# EasyEDA Pro project stm32手表_2024-06-10.epro, board PCB1
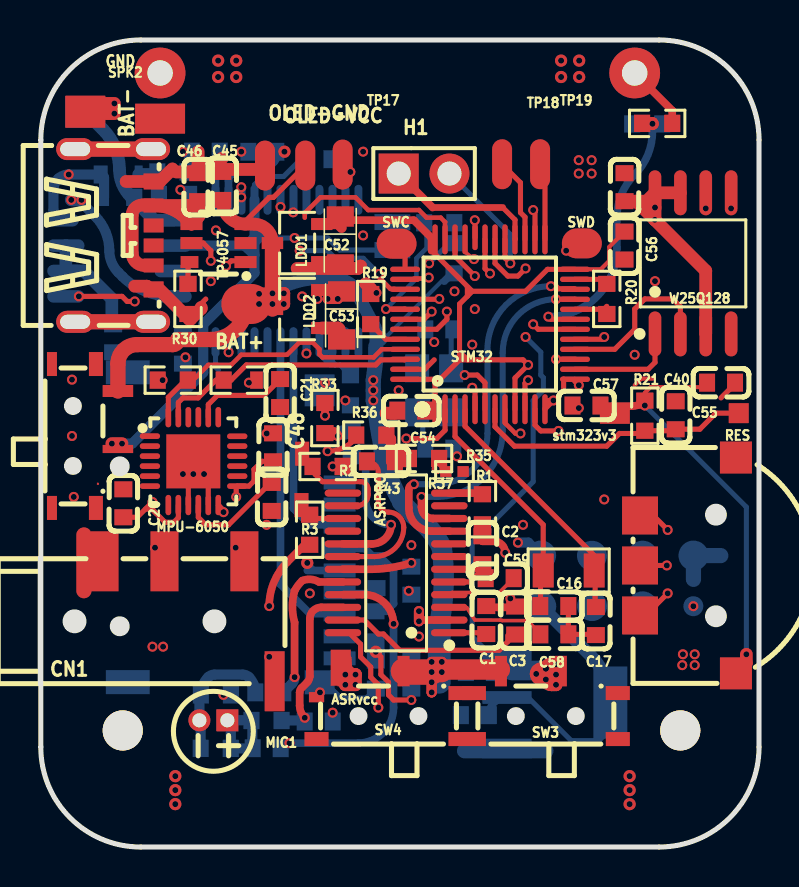
[diagram p1: board, top side]
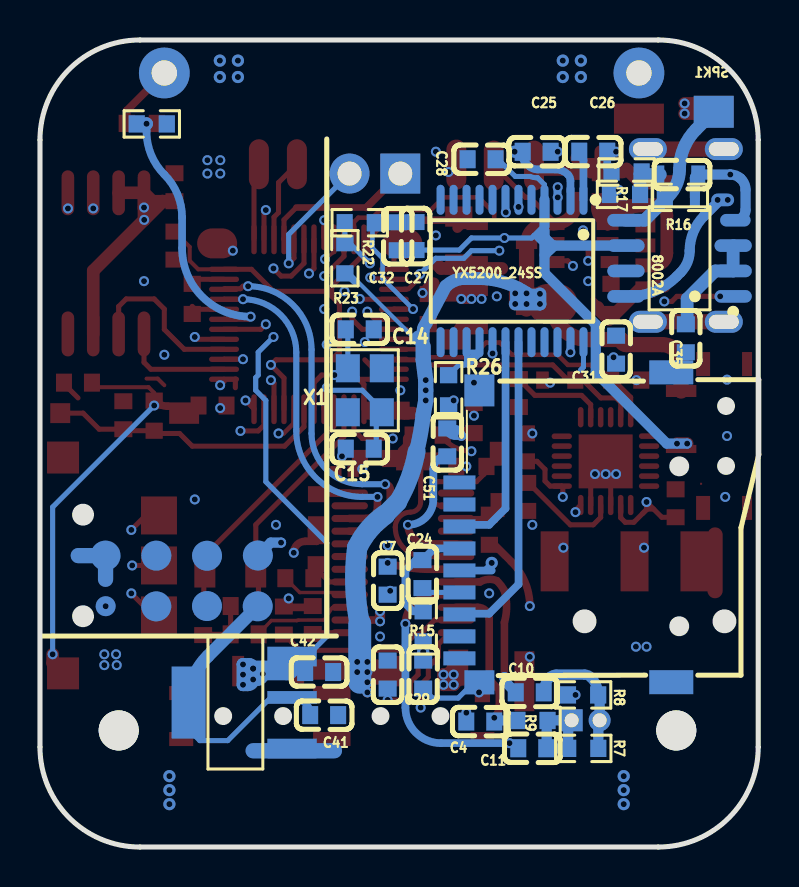
[diagram p2: board, bottom side, seen from below]

Outline 35.94 x 40.38 mm; copper layers: Top Layer, Inner1, Inner2, Bottom Layer. Coordinates in mm from the lower left corner of the outline.
Outline path: 0,35.38 0,5 arc(1.46,1.46) 5,0 30.94,0 arc(34.48,1.46) 35.94,5 35.94,35.38 arc(34.48,38.91) 30.94,40.38 5,40.38 arc(1.46,38.91) 0,35.38
Stack: Top Layer 0.035mm 外层铜厚1oz / Dielectric1 0.2104mm 7628 RC49% 8.6mil / Inner1 0.0152mm 内层铜厚 / Dielectric2 1.065mm 1.1mm H/HOZ 含铜 / Inner2 0.0152mm 内层铜厚 / Dielectric3 0.2104mm 7628 RC49% 8.6mil / Bottom Layer 0.035mm 外层铜厚1oz

## Design rules (mm)
template: JLCPCB Capability(Two Layers Board)
spacing copperThickness1oz (default): track to track 0.102, other pairs 0.152 to 0.3
spacing copperThickness2oz: track to track 0.203, other pairs 0.152 to 0.3
track width copperThickness1oz (default): min 0.127, default 0.254, max 2.54
track width copperThickness2oz: min 0.203, default 0.254, max 2.54
differential pair differentialPair (default): width min 0.127, default 0.254, max 2.54; gap min 0.152, default 0.152
via viaSize (default): diameter min 0.5, default 0.61, max 10; hole min 0.3, default 0.305, max 6.3

## Placement (name value [footprint] x y rotation side)
8002A  AiP8002SA.TR  [sop-8_l4.9-w3.9-p1.27-ls6.0-bl]  3.94 29.45 90 bottom
ASR_DL_RX  -  [test-point-0.5mm#2]  13.04 17.11 0 top
ASR_DL_TX  -  [test-point-0.5mm#2]  13.08 19.67 0 top
ASRPRO  ASRPRO-2M  [SSOP-24_L8.7-W3.9-P0.64-LS6.0-BL-1]  17.78 14.21 90 top
ASRvcc  -  [test-point-0.5mm#3]  15.01 8.97 0 top
BAT+  -  [test-point-0.5mm#4]  10.29 27.17 270 top
BAT-  -  [test-point-0.5mm#5]  5.97 36.44 270 top
C1  4.7uF  [C0603]  22.29 11.36 90 top
C2  4.7uF  [C0603]  22.1 14.85 270 top
C3  4.7uF  [C0603]  23.74 11.33 90 top
C4  4.7uF  [C0603]  13.91 6.28 0 bottom
C7  100nF  [C0603]  18.54 13.33 270 bottom
C10  100nF  [C0603]  11.43 7.74 0 bottom
C11  100nF  [C0603]  11.31 4.94 0 bottom
C14  18pF  [C0603]  19.94 25.9 180 bottom
C15  18pF  [C0603]  19.94 19.93 0 bottom
C16  10pF  [C0603]  25.7 12.06 0 top
C17  10pF  [C0603]  27.77 11.3 270 top
C20  10nF  [C0603]  4.13 17.2 90 top
C21  2.2nF  [C0603]  11.98 22.71 270 top
C24  10uF  [C0603]  16.8 13.65 90 bottom
C25  10uF  [C0603]  11.09 34.78 180 bottom
C26  10uF  [C0603]  8.25 34.79 180 bottom
C27  100nF  [C0603]  17.15 30.57 270 bottom
C28  10uF  [C0603]  13.84 34.41 0 bottom
C29  10uF  [C0603]  18.54 8.63 90 bottom
C30  100nF  [C0603]  16.76 8.63 90 bottom
C31  10uF  [C0603]  7.11 24.88 270 bottom
C32  10uF  [C0603]  18.04 30.55 270 bottom
C34  100nF  [c0603]  3.81 33.64 0 bottom
C35  1uF  [C0603]  3.62 25.45 90 bottom
C40  1uF  [C0603]  31.77 21.6 270 top
C41  10uF  [C0603]  21.72 6.6 0 bottom
C42  10uF  [C0603]  21.97 8.75 180 bottom
C43  100nF  [C0603]  17.02 19.29 180 top
C45  10uF  [C0603]  9.08 33.08 90 top
C46  10uF  [C0603]  7.88 33.01 90 top
C48  100nF  [C0603]  11.62 20 90 top
C49  100nF  [C0603]  11.56 17.52 90 top
C50  100nF  [C0603]  29.21 33.01 270 top
C51  100nF  [C0603]  15.56 20.25 270 bottom
C52  10uF  [case-a_3216]  14.99 30.34 270 top
C53  10uF  [case-a_3216]  15.05 26.59 270 top
C54  100nF  [C0603]  18.54 21.83 0 top
C55  100nF  [C0603]  34.04 23.23 180 top
C56  10uF  [C0603]  29.21 30.09 90 top
C57  100nF  [C0603]  27.31 22.09 0 top
C58  4.7uF  [C0603]  25.7 10.64 180 top
C59  4.7uF  [C0603]  22.96 13.45 0 top
CARD1  TF-01A  [TF-SMD_TF-02]  9.65 15.99 90 bottom
CN1  PJ-320D  [audio-smd_pj-320d]  7.24 11.29 90 top
H1  PZ254V-11-02P  [HDR-TH_2P-P2.54-V-M]  19.18 33.69 0 top
LDO1  ME6209A33M3G  [SOT-23-3_L2.9-W1.6-P1.90-LS2.8-BR]  12.83 30.22 0 top
LDO2  ME6209A33M3G  [SOT-23-3_L2.9-W1.6-P1.90-LS2.8-BR]  12.83 26.91 0 top
MIC1  4015P  [MIC-TH_BD4.0-P1.40-D0.4-L-FD]  8.64 6.34 180 top
MPU-6050  MPU-6050  [qfn-24_l4.0-w4.0-p0.50-bl-ep2.7]  7.63 19.31 270 top
NOREF  -  [Pad_e32]  32 5.83 0 top
NOREF#2  -  [Pad_e629]  5.97 38.73 315 top
NOREF#3  -  [Pad_e594]  29.72 38.73 315 top
NOREF#4  -  [Pad_e10]  4.1 5.83 0 top
OLED-GND  -  [test-point-0.5mm#6]  11.22 34.09 0 top
OLED-VCC  -  [test-point-0.5mm#6]  13.23 34.09 0 top
R1  10K  [R0603]  22.1 16.9 90 top
R2  10K  [R0603]  14.35 19.04 180 top
R3  10K  [R0603]  13.45 15.87 90 top
R7  10kΩ  [R0603]  8.75 4.93 0 bottom
R8  2.2kΩ  [R0603]  8.76 7.61 0 bottom
R9  2.2kΩ  [R0603]  11.29 6.33 0 bottom
R15  3.3Ω  [R0603]  16.76 11.04 270 bottom
R16  24kΩ  [r0603#2]  3.92 32.5 0 bottom
R17  22kΩ  [R0603]  6.67 32.65 180 bottom
R18  22kΩ  [R0603]  6.59 33.77 180 bottom
R19  10kΩ  [R0603]  16.51 26.91 270 top
R20  10kΩ  [R0603]  28.32 27.42 90 top
R21  10kΩ  [R0603]  30.23 21.58 270 top
R22  33kΩ  [R0603]  19.94 31.23 180 bottom
R23  33kΩ  [R0603]  20.68 29.45 90 bottom
R24  43kΩ  [R0603]  30.84 36.2 0 top
R25  5.1kΩ  [R0603]  30.34 36.18 180 bottom
R26  33K  [R0603]  15.49 22.85 270 bottom
R30  3K  [R0603]  7.37 27.42 270 top
R31  4.7K  [R0603]  6.6 23.36 180 top
R32  4.7K  [r0603]  9.91 23.36 0 top
R33  4.7K  [R0603]  14.22 21.46 270 top
R35  0Ω  [R0402]  20.7 18.79 180 top
R36  22kΩ  [R0603]  16.54 20.61 180 top
R37  4.7kΩ  [R0603]  19.18 19.44 0 top
RES  -  [test-point-0.5mm#7]  34.93 21.71 0 top
SPK1  -  [test-point-0.5mm#8]  2.23 36.78 180 top
SPK2  -  [test-point-0.5mm#9]  2.23 36.79 180 top
STM32  STM32F103C8T6  [lqfp-48_l7.0-w7.0-p0.50-ls9.0-bl]  22.48 26.15 0 top
stm323v3  -  [test-point-0.5mm]  28.73 21.67 0 top
SW1  K1-1502SA-02  [KEY-SMD_K1-1502SA-02]  32.38 14.09 270 top
SW2  MSK12C02  [sw-th_msk12c02]  2.16 20.56 270 top
SW3  MSK12C02  [sw-th_msk12c02#3]  25.27 7.1 0 top
SW4  MSK12C02  [sw-th_msk12c02#2]  17.4 7.1 0 top
SWC  -  [test-point-0.5mm#10]  17.8 30.18 0 top
SWD  -  [test-point-0.5mm#10]  27.07 30.2 0 top
TP1  -  [test-point-0.5mm#11]  25.04 12.04 180 bottom
TP2  -  [test-point-0.5mm#11]  27.58 12.06 180 bottom
TP3  -  [test-point-0.5mm#11]  30.12 12.04 180 bottom
TP4  -  [test-point-0.5mm#12]  32.65 12.05 180 bottom
TP11  -  [test-point-0.5mm#11]  25.04 14.59 180 bottom
TP12  -  [test-point-0.5mm#11]  27.58 14.57 180 bottom
TP13  -  [test-point-0.5mm#11]  30.12 14.58 180 bottom
TP14  -  [test-point-0.5mm#11]  32.66 14.58 180 bottom
TP17  -  [test-point-0.5mm#6]  15.1 34.14 0 top
TP18  -  [test-point-0.5mm#6]  23.08 34.16 0 top
TP19  -  [test-point-0.5mm#6]  24.99 34.16 180 top
TP4057  TP4057  [sot-23-6_l2.9-w1.6-p0.95-ls2.8-br]  8.89 30.22 0 top
TYPE-C  TYPE-C 6P(073)  [TYPE-C-SMD_TYPE-C-6P]  3.68 30.6 270 top
U9  AMS1117-3.3  [sot-223-4_l6.5-w3.5-p2.30-ls7.0-br]  26.16 7.23 180 bottom
W25Q128  W25Q128JVSIQ  [SOIC-8_L5.3-W5.3-P1.27-LS8.0-BL]  32.64 29.2 0 top
X1  8MHz  [CRYSTAL-SMD_4P-L3.2-W2.5-BL]  19.69 22.85 270 bottom
X2  32.768kHz  [OSC-SMD_L3.2-W1.5]  26.42 13.83 180 top
YX5200_24SS  YX5200-24SS  [SSOP-24_L8.2-W5.3-P0.65-LS7.8-BL]  12.32 28.82 0 bottom

## Footprints (pads in the part's own frame, mm; a bottom-side part is the same pattern mirrored in y, then rotated)
audio-smd_pj-320d
  rect 3x1 smd: 1(-3,-4.461)
  rect 3x1.4 smd: 2(3,4.05) 3(3,1.05) 4(3,-2.95)
C0603
  rect 0.8x0.9 smd: 1(-0.7,0) 2(0.7,0)
c0603
  rect 0.7x0.9 smd: 1(-0.813,0)
  rect 0.4x0.9 smd: 2(1.087,0)
case-a_3216
  rect 1.016x1.359 smd: 1(-1.2,0) 2(1.2,0)
CRYSTAL-SMD_4P-L3.2-W2.5-BL
  rect 1.4x1.2 smd: 1(-1.1,-0.85) 2(1.1,-0.85) 3(1.1,0.85) 4(-1.1,0.85)
HDR-TH_2P-P2.54-V-M
  rect 2x2 hole 1.2: 1(-1.27,0)
  round 2 hole 1.2: 2(1.27,0)
KEY-SMD_K1-1502SA-02
  rect 1.9x1.8 smd: 1(-2.5,-2.4) 2(2.5,-2.4) T(0,-2.4)
  rect 1.6x1.6 smd: 3(-5.4,2.4) C(5.4,2.4)
lqfp-48_l7.0-w7.0-p0.50-ls9.0-bl
  oval 0.27x1.5 smd: 1(-2.75,-4.25) 2(-2.25,-4.25) 3(-1.75,-4.25) 4(-1.25,-4.25) 5(-0.75,-4.25) 6(-0.25,-4.25) 7(0.25,-4.25) 8(0.75,-4.25) 9(1.25,-4.25) 10(1.75,-4.25) 11(2.25,-4.25) 12(2.75,-4.25) 25(2.75,4.25) 26(2.25,4.25) 27(1.75,4.25) 28(1.25,4.25) 29(0.75,4.25) 30(0.25,4.25) 31(-0.25,4.25) 33(-1.25,4.25) 34(-1.75,4.25) 35(-2.25,4.25) 36(-2.75,4.25)
  oval 1.5x0.27 smd: 13(4.25,-2.75) 14(4.25,-2.25) 15(4.25,-1.75) 16(4.25,-1.25) 17(4.25,-0.75) 18(4.25,-0.25) 19(4.25,0.25) 20(4.25,0.75) 21(4.25,1.25) 22(4.25,1.75) 23(4.25,2.25) 24(4.25,2.75) 37(-4.25,2.75) 38(-4.25,2.25) 39(-4.25,1.75) 40(-4.25,1.25) 41(-4.25,0.75) 42(-4.25,0.25) 43(-4.25,-0.25) 44(-4.25,-0.75) 45(-4.25,-1.25) 46(-4.25,-1.75) 47(-4.25,-2.25) 48(-4.25,-2.75)
  oval 0.27x1.27 smd: 32(-0.75,4.343)
MIC-TH_BD4.0-P1.40-D0.4-L-FD
  rect 1.1x1.1 hole 0.7: 1(-0.7,0)
  round 1.1 hole 0.7: 2(0.7,0)
OSC-SMD_L3.2-W1.5
  rect 1.05x1.7 smd: 1(-1.275,0) 2(1.275,0)
Pad_e10
  round 2 hole 2: 51(0,0)
Pad_e32
  round 2 hole 2: 53(0,0)
Pad_e594
  round 2.54 hole 1.27: 49(0,0)
Pad_e629
  round 2.54 hole 1.27: 50(0,0)
qfn-24_l4.0-w4.0-p0.50-bl-ep2.7
  oval 0.28x1.016 smd: 1(-1.25,-2.171) 2(-0.75,-2.171) 3(-0.25,-2.171) 4(0.25,-2.171) 5(0.75,-2.171) 6(1.25,-2.171) 13(1.25,2.197) 14(0.75,2.197) 15(0.25,2.197) 16(-0.25,2.197) 17(-0.75,2.197) 18(-1.242,2.197)
  oval 1.016x0.28 smd: 7(2.197,-1.25) 8(2.197,-0.75) 9(2.197,-0.25) 10(2.197,0.25) 11(2.197,0.75) 12(2.197,1.25) 19(-2.197,1.25) 20(-2.197,0.75) 21(-2.197,0.25) 22(-2.197,-0.25) 23(-2.197,-0.75) 24(-2.197,-1.25)
  rect 2.7x2.7 smd: 25(0.013,0)
R0402
  rect 0.566x0.54 smd: 1(-0.433,0) 2(0.433,0)
r0603
  rect 0.806x0.864 smd: 1(-0.753,0)
  rect 0.635x0.864 smd: 2(0.889,0)
R0603
  rect 0.806x0.864 smd: 1(-0.753,0) 2(0.753,0)
r0603#2
  rect 0.5x0.864 smd: 1(-0.753,0)
  rect 0.806x0.864 smd: 2(0.753,0)
SOIC-8_L5.3-W5.3-P1.27-LS8.0-BL
  oval 0.63x2.25 smd: 1(-1.905,-3.53) 2(-0.635,-3.53) 3(0.635,-3.53) 4(1.905,-3.53) 5(1.905,3.53) 6(0.635,3.53) 7(-0.635,3.53) 8(-1.905,3.53)
sop-8_l4.9-w3.9-p1.27-ls6.0-bl
  oval 0.63x1.865 smd: 1(-1.905,-2.683) 2(-0.635,-2.683) 3(0.635,-2.683) 5(1.905,2.683) 6(0.635,2.683) 7(-0.635,2.683) 8(-1.905,2.683)
  oval 0.63x1.524 smd: 4(1.905,-2.794)
SOT-23-3_L2.9-W1.6-P1.90-LS2.8-BR
  rect 1.07x0.6 smd: 1(1.235,-0.95) 2(1.235,0.95) 3(-1.235,0)
sot-23-6_l2.9-w1.6-p0.95-ls2.8-br
  rect 1.1x0.6 smd: 1(1.35,-0.95) 2(1.35,0) 3(1.35,0.95) 4(-1.35,0.95) 5(-1.35,0)
  rect 0.889x0.6 smd: 6(-1.448,-0.95)
sot-223-4_l6.5-w3.5-p2.30-ls7.0-br
  rect 2.47x0.98 smd: 1(2.835,-2.3) 3(2.835,2.3)
  rect 2.47x0.635 smd: 2(2.835,0.254)
  rect 1.7x3.6 smd: 4(-2.338,0)
SSOP-24_L8.2-W5.3-P0.65-LS7.8-BL
  oval 0.4x1.5 smd: 1(-3.575,-3.562) 2(-2.925,-3.562) 3(-2.275,-3.562) 4(-1.625,-3.562) 5(-0.975,-3.562) 6(-0.325,-3.562) 7(0.325,-3.562) 8(0.975,-3.562) 9(1.625,-3.562) 10(2.275,-3.562) 11(2.925,-3.562) 12(3.575,-3.562) 13(3.575,3.562) 14(2.925,3.562) 15(2.275,3.562) 16(1.625,3.562) 17(0.975,3.562) 18(0.325,3.562) 19(-0.325,3.562) 20(-0.975,3.562) 21(-1.625,3.562) 22(-2.275,3.562) 23(-2.925,3.562) 24(-3.575,3.562)
SSOP-24_L8.7-W3.9-P0.64-LS6.0-BL-1
  oval 0.355x1.824 smd: 1(-3.493,-2.662) 2(-2.857,-2.662) 3(-2.223,-2.662) 4(-1.587,-2.662) 5(-0.953,-2.662) 6(-0.318,-2.662) 7(0.318,-2.662) 8(0.953,-2.662) 9(1.587,-2.662) 10(2.223,-2.662) 11(2.857,-2.662) 12(3.493,-2.662) 13(3.493,2.662) 14(2.857,2.662) 15(2.223,2.662) 16(1.587,2.662) 17(0.953,2.662) 18(0.318,2.662) 19(-0.318,2.662) 20(-0.953,2.662) 21(-1.587,2.662) 22(-2.223,2.662) 23(-2.857,2.662) 24(-3.493,2.662)
sw-th_msk12c02
  rect 0.6x1.524 smd: 1(-2.25,1.7)
  rect 0.406x1.524 smd: 2(0.65,1.7)
  rect 0.1x0.1 smd: 3(2.391,0.7)
  rect 1.2x0.7 smd: 4(-3.6,0.6) 4(3.6,0.6)
  rect 1.2x0.5 smd: 4(-3.6,-1.6) 4(3.6,-1.6)
sw-th_msk12c02#2
  rect 0.6x1.524 smd: 1(-2.25,1.7) 2(0.75,1.7)
  rect 0.003x0.003 smd: 3(1.25,0.7)
  rect 0.762x0.508 smd: 4(-3.6,0.396)
  rect 1.2x0.7 smd: 4(-3.6,-1.7) 4(3.6,0.6) 4(3.6,-1.7)
sw-th_msk12c02#3
  rect 0.6x1.524 smd: 1(-2.25,1.7) 2(0.75,1.7)
  rect 0.003x0.003 smd: 3(1.25,0.7)
  rect 1.2x0.7 smd: 4(-3.6,0.6) 4(-3.6,-1.7) 4(3.6,0.6) 4(3.6,-1.7)
test-point-0.5mm
  rect 1.5x1 smd: 1(0,0)
test-point-0.5mm#2
  rect 0.7x1.2 smd: 1(0,0)
test-point-0.5mm#3
  rect 1x1.8 smd: 1(0,0)
test-point-0.5mm#4
  oval 2x2.5 smd: 1(0,0)
test-point-0.5mm#5
  rect 1.5x2.5 smd: 1(0,0)
test-point-0.5mm#6
  oval 1x2.5 smd: 1(0,0)
test-point-0.5mm#7
  rect 1x1 smd: 1(0,0)
test-point-0.5mm#8
  rect 2x1.6 smd far side: 1(0,0)
test-point-0.5mm#9
  rect 2x1.6 smd: 1(0,0)
test-point-0.5mm#10
  oval 2x1.5 smd: 1(0,0)
test-point-0.5mm#11
  round 1.5 smd: 1(0,0)
test-point-0.5mm#12
  round 1 smd: 1(0,0)
TF-SMD_TF-02
  rect 0.7x1.6 smd: 1(2.245,5.3) 2(1.145,5.3) 3(0.046,5.3) 4(-1.054,5.3) 5(-2.155,5.3) 6(-3.255,5.3) 7(-4.354,5.3) 8(-5.454,5.3) 9(-6.554,5.3)
  rect 1.2x1.5 smd: 10(-7.754,4.3)
  rect 1.2x2.2 smd: 11(-7.746,-5.3) 12(7.754,-5.3)
  rect 1.6x1.5 smd: 13(6.854,4.3)
TYPE-C-SMD_TYPE-C-6P
  oval 1.1x1.9 hole 0.7x1.5: 7(-4.32,1.837) 7(-4.32,-1.962) 7(4.32,1.837) 7(4.32,-1.962)
  rect 0.7x1 smd: A5(-0.5,1.962) A9(1.5,1.962) B5(0.5,1.962) B9(-1.5,1.962)
  rect 0.8x1 smd: A12(2.7,1.962) B12(-2.7,1.962)

## Nets
As in the schematic, except:
GND: 8002A.7 ASRPRO.5 ASRPRO.8 BAT-.1 C2.2 C14.2 C15.2 C16.2 C17.2 C20.2 C21.2 C24.1 C27.1 C28.2 C29.2 C30.1 C31.1 C32.1 C35.1 C40.1 C41.1 C42.2 C45.2 C46.2 C48.2 C49.1 C50.1 C52.2 C53.2 C54.1 C55.1 C56.1 C57.1 C58.1 C59.1 CARD1.6 CARD1.10 CARD1.11 CARD1.12 CARD1.13 CN1.2 LDO1.1 LDO2.1 MPU-6050.1 MPU-6050.9 MPU-6050.11 MPU-6050.18 MPU-6050.25 NOREF#2.50 OLED-GND.1 R19.1 R20.2 R25.2 R30.2 R35.1 STM32.8 STM32.23 STM32.35 STM32.47 SW2.4 SW3.4 SW4.4 TP14.1 TP4057.2 TYPE-C.7 TYPE-C.A12 TYPE-C.B12 U9.1 W25Q128.4 X1.2 X1.4 YX5200_24SS.5 YX5200_24SS.24
ADCSBQ: NOREF#3.49 R24.2
ASRPROVCC: ASRPRO.2 ASRvcc.1 C2.1 R1.1 R2.1 R3.1 STM32.43 SW4.1

Pads without a net: CARD1 1 2 8 9; MPU-6050 2 3 4 5 6 7 14 15 16 17 19 21 22; NOREF 53; NOREF#4 51; SW1 3; SW2 3; SW3 3; SW4 3; TP2 1; TP3 1; TP12 1; TP13 1; TYPE-C A5 B5; YX5200_24SS 8 9 10 11 12 13 14 20 21 22

## Via types
v1: diameter 0.5, hole 0.3, Top Layer to Bottom Layer, 167 vias
v2: diameter 0.61, hole 0.305, Top Layer to Bottom Layer, 18 vias

## Routing (per net, layer and track width the routed paths; a pad name or vN(x,y) marks a point on that pad's centre or on a via; arc(x,y) is an arc through that point)
3V3: length 71.1
  Top Layer w0.254: 5.23,16.91 5.56,16.91 5.79,16.68 ; v1(9.78,17.52) 9.78,18.01 MPU-6050.13 10.41,18.06 10.67,18.31 10.67,18.89 11.07,19.3 11.88,19.3 ; C20.1 4.82,16.5 v1(5.59,17.26) 5.59,16.88 6.22,16.25 6.65,16.25 6.88,16.47 MPU-6050.8
  Top Layer w0.508: v1(14.35,27.42) v1(14.86,27.42) 15.18,27.74 15.18,27.86 LDO2.2
  Top Layer w0.635: v1(30.72,31.38) 29.79,32.31 ; v1(30.72,31.38) 30.73,31.39 v1(30.73,31.99) W25Q128.8 ; v1(30.72,31.38) 33.27,28.83 W25Q128.3 ; 29.79,32.31 30.31,32.31 W25Q128.8 ; 29.79,32.31 C50.2 ; W25Q128.8 W25Q128.7
  Inner1 w0.508: 13.8,26.6 14.62,27.42 v1(14.86,27.42) ; v1(10.41,23.23) 13.84,26.66 v1(13.84,27.42)
  Inner1 w0.635: v1(13.84,27.42) v1(14.35,27.42) v1(14.86,27.42)
  Inner2 w0.254: 17.15,29.96 16.38,29.96 v1(13.84,27.42)
  Inner2 w0.508: v1(13.84,27.42) v1(14.86,27.42) ; 18,29.98 16.91,29.98 v1(14.35,27.42) ; 17.79,29.98 17.98,30.17 19.29,30.17 arc(19.69,30.21) 20.08,30.22 23.46,30.22 arc(24.78,30.48) 25.91,31.23 arc(26.75,31.8) 27.75,31.99 v1(30.73,31.99) 30.73,31.39 v1(30.72,31.38) 30.12,31.98 30.12,31.99 ; v1(6.1,23.36) 10.29,23.36 arc(10.38,23.32) v1(10.41,23.23) 10.41,18.15 arc(10.23,17.7) v1(9.78,17.52) 5.84,17.52 arc(5.66,17.44) v1(5.59,17.26)
GND: length 69.7
  Top Layer w0.203: 29.72,23.1 30.05,23.44 30.61,23.44
  Top Layer w0.229: v1(24,20.69) 23.75,20.69 23.23,21.21 STM32.8 ; STM32.35 20.23,31.27 20.01,31.49 19.3,31.49 18.92,31.87 16.38,31.87 15.75,32.5 14,32.5 13.21,31.71 13.21,31.49
  Top Layer w0.254: 6.13,27.56 7.07,26.63 7.47,26.63 8.26,27.41 ; C17.2 27.74,10.64 C58.1 26.4,12.06 ; 22.1,13.9 21.46,13.26 ASRPRO.5 ; MPU-6050.11 8.38,18.54 MPU-6050.25 arc(7.45,19.02) 7.38,18.69 MPU-6050.9 ; R20.2 28.32,28.25 28.17,28.4 STM32.23 ; 34.04,22.47 34.74,23.17 34.74,23.23 ; 19.69,24.37 19.21,23.9 STM32.47
  Top Layer w0.635: 4.27,33.3 5.96,33.3 6.59,33.93 ; 4.7,28.06 5.31,28.06 5.46,27.91 ; 5.94,27.9 7.43,26.41 7.49,26.41 8.03,26.94 8.03,27 ; 6.77,33.77 8.39,33.77 9.08,34.47 ; 8.59,34.15 7.87,34.15 7.87,34.79 ; C45.2 9.21,33.9 11.05,33.9 ; R19.1 16.51,27.93 16.26,28.18 ; LDO2.1 14.86,25.96 14.92,25.9 14.92,25.4 ; 17.27,21.71 17.72,21.71 C54.1 ; 16,29.07 15.88,28.95 12.83,28.95
  Top Layer w0.762: 2.16,15.61 2.16,12.83 ; TYPE-C.7 TYPE-C.7 ; TYPE-C.7 TYPE-C.7
  Bottom Layer w0.254: 14.48,7.99 15.02,7.45 16.29,7.45 C30.1 ; CARD1.6 16.59,12.74 C24.1 ; 8.89,23.87 8.74,24.01 YX5200_24SS.24
  Bottom Layer w0.762: 21.21,4.82 25.27,4.82 ; 32.66,13.39 TP14.1 34.02,14.58
  vias: v1(1.56,23.38) v1(1.56,20.56) v1(1.65,17.52) v1(5.59,10.02) v1(6.12,10.02) v1(7.11,18.66) v1(7.63,18.66) v1(8.17,18.66) v1(8.51,28.31) v1(8.76,30.85) v1(11.3,20.69) v1(11.3,16.12) v1(13.08,27.55) v1(13.46,12.69) v1(13.97,7.74) v1(14.22,23.23) v1(16.13,34.79) v1(16.13,30.6) v1(16.8,27.72) v1(18.92,10.53) v1(19.69,25.26) v1(20.7,27.8) v1(20.83,19.55) v1(21.59,25.14) v1(21.72,26.91) v1(24.13,16.12) v1(26.92,34.36) v1(26.92,33.69) v1(26.92,21.96) v1(27.56,34.36) v1(27.56,33.69) v1(28.19,17.39) v1(29.72,24.63) v1(30.73,28.31) v1(32.13,9.64) v1(32.1,9.1) v1(32.72,9.64) v1(32.72,9.1) v2(6.73,3.55) v2(6.73,2.85) v2(6.73,2.15) v2(8.87,39.34) v2(8.87,38.52) v2(9.78,39.34) v2(9.78,38.52) v2(26.03,39.34) v2(26.03,38.52) v2(26.94,39.34) v2(26.94,38.52) v2(29.46,3.55) v2(29.46,2.85) v2(29.46,2.15)
ADC1: length 14.5
  Top Layer w0.254: STM32.19 25.53,26.4 v1(25.4,26.53)
  Top Layer w0.635: R24.1 30.59,36.2 v2(30.61,36.19)
  Bottom Layer w0.381: v2(30.61,36.19) 30.61,35.79 arc(30.38,34.63) 29.72,33.65 arc(29.06,32.66) 28.83,31.5 28.83,29.96 arc(27.82,27.54) v1(25.4,26.53)
  Bottom Layer w0.635: v2(30.61,36.19) 30.62,36.18 31.14,36.18
ADCLK: length 13.9
  Inner2 w0.508: v1(13.29,24.69) 13.29,14.26 v2(13.34,14.21)
  Bottom Layer w0.254: CARD1.5 13.71,13.84 v2(13.34,14.21)
  Bottom Layer w0.381: 13.34,13.83 14.95,13.83 CARD1.5
ADCMD: length 11
  Bottom Layer w0.381: YX5200_24SS.18 12.64,16.94 13.46,16.12 14.87,16.12 CARD1.3
ADCSBQ: length 3.3
  Top Layer w0.381: NOREF#3.49 31.6,36.85 R24.2
ADDAT: length 15.7
  Bottom Layer w0.381: CARD1.7 14.92,11.67 13.46,11.67 11.99,13.14 YX5200_24SS.19
APKOFF: length 25.2
  Top Layer w0.178: 21.23,29.77 v1(21.68,29.41)
  Top Layer w0.254: v1(1.91,27.55) 4.07,27.55 4.32,27.3 v1(4.7,27.3)
  Inner1 w0.229: 19.73,31.36 16.26,31.36 ; v1(21.68,29.41) 19.73,31.36
  Inner1 w0.254: 16.26,31.36 15.62,31.36 13.84,33.14 11.94,33.14 10.29,31.49 10.29,30.85 9.53,30.09 6.73,30.09 4.7,28.06 v1(4.7,27.3)
ASR1V1: length 3.1
  Top Layer w0.178: 23.36,13.16 22.94,12.74 ; 20.48,12.63 20.58,12.73 22.94,12.73
ASR3V3: length 4.7
  Top Layer w0.178: 24.8,10.87 24.36,11.33 23.09,11.33 23,11.35 21.72,11.36 21.32,11.97 20.61,12.02
ASR_RX: length 17.2
  Top Layer w0.254: v1(25.78,27.41) 26.72,27.41 STM32.21
  Top Layer w0.381: ASRPRO.10 19.62,16.44 arc(19.22,16.6) 19.05,17.01 v1(19.05,17.52)
  Bottom Layer w0.305: v1(19.05,17.52) 19.81,17.52 arc(22.15,18.48) 23.11,20.82 23.11,24.74 arc(23.9,26.63) v1(25.78,27.41)
ASR_TX: length 19.6
  Top Layer w0.254: v1(25.53,28.06) 25.78,28.06 25.91,27.93 26.7,27.93 STM32.22
  Top Layer w0.381: ASRPRO.9 19.58,15.8 arc(18.76,16.14) 18.41,16.97 18.41,17.9 arc(18.49,18.08) v1(18.67,18.15)
  Bottom Layer w0.305: v1(18.67,18.15) 19.81,18.15 arc(21.61,18.89) 22.35,20.69 22.35,24.88 arc(23.28,27.13) v1(25.53,28.06)
ASRPA4: length 1.7
  Top Layer w0.381: ASRPRO.12 22.04,17.71 arc(22.08,17.69) R1.2
ASRPRO_AGND: length 39.4
  Top Layer w0.254: v1(16.89,6.98) 16.89,8.12 16.51,8.5 16.51,9.01 16,9.52 16,10.15 15.43,10.72 ASRPRO.24
  Top Layer w0.381: 23.37,11.99 22.36,11.99 arc(22.31,12.01) C1.2
  Inner1 w0.381: 18.64,9.9 18.64,9.85 18.2,9.41 ; 18.64,9.9 18.29,10.24 18.29,10.35 ; 18.64,9.9 20.96,9.9 v1(23.5,12.44) ; 18.64,9.9 18.42,9.9 ; 18.29,10.35 18.29,12.84 arc(18.36,12.89) v1(18.41,12.82) ; 18.29,10.35 arc(17.92,8.52) v1(16.89,6.98)
  Inner2 w0.381: 14.88,5.68 14.88,5.63 arc(14.83,5.39) 14.7,5.2 ; 15.88,5.2 16,5.2 arc(16.9,5.57) 17.27,6.47 17.27,6.59 arc(17.16,6.86) v1(16.89,6.98) ; 15.88,5.2 14.72,5.2 arc(13.56,5.43) 12.57,6.09 12.4,6.26 arc(10.9,7.26) v1(9.14,7.61) ; 15.88,5.2 arc(14.98,5.57) 14.61,6.47 v1(14.6,6.72) ; v1(19.81,18.91) 19.81,14.72 arc(19.41,13.55) v1(18.41,12.82)
ASRPROVCC: length 58.6
  Top Layer w0.254: STM32.43 19.82,25.9 20.32,26.41 v1(20.32,26.79)
  Top Layer w0.381: ASRPRO.2 18.99,11.36 arc(18.94,11.34) v1(18.92,11.29) ; R1.1 22.1,15.3 22.67,15.3 arc(23.07,15.13) v1(23.24,14.72) ; 13.2,15.12 12.35,14.27 arc(11.67,13.25) v1(11.43,12.06)
  Top Layer w0.508: v1(18.92,11.29) v1(18.92,11.8)
  Top Layer w0.635: 15.24,9.39 15.24,9.13 arc(15.39,8.77) v1(15.75,8.63) ; v1(15.75,8.63) v1(15.24,8.63) v1(15.24,8.12) v1(15.75,8.12) v1(15.75,8.63)
  Inner1 w0.381: v1(23.24,14.72) 21.84,14.72 arc(19.78,13.87) v1(18.92,11.8)
  Inner2 w0.254: v1(18.92,11.8) 21.46,14.34 21.46,19.8 20.32,20.95 v1(20.32,26.79) ; v1(14.6,19.04) 14.61,12.94 13.72,12.06 v1(11.43,12.06)
  Inner2 w0.381: v1(18.92,11.29) 18.8,11.29 17.78,10.28 17.78,9.77 16.64,8.63 v1(15.75,8.63) ; v1(11.43,12.06) 15.15,8.34 arc(15.22,8.24) v1(15.24,8.12)
  Inner2 w0.508: v1(18.92,11.8) v1(18.92,11.29) ; v1(15.24,8.63) v1(15.75,8.63) v1(15.75,8.12) v1(15.24,8.12) v1(15.24,8.63)
BAT+: length 82
  Top Layer w0.254: 12.14,27.68 v1(10.92,27.68) 12.14,27.68 ; 12.14,27.68 v1(12.16,27.7) ; TP4057.3 10.24,31.31 11.43,32.5 11.64,32.5 OLED-VCC.1
  Top Layer w0.508: v1(19.56,8.25) v1(19.56,7.74) v1(19.56,8.25) ; v1(19.56,8.25) arc(19.71,8.6) v1(20.07,8.75) v1(20.07,9.26) v1(19.56,9.26) v1(19.56,8.75) v1(19.56,8.25)
  Top Layer w0.635: v1(10.92,27.68) 12.14,27.68 v1(12.16,27.7) v1(12.16,27.17) v1(10.92,27.17) ; C45.1 9.08,32.32 arc(9.42,31.51) TP4057.3 10.64,31.17 arc(11.31,30.89) LDO1.3
  Top Layer w0.762: LDO2.3 v1(11.59,27.17) v1(11.59,27.7) LDO1.3 ; 3.86,22.81 3.86,24.17 arc(4.14,24.85) 4.83,25.14 6.6,25.14 arc(6.78,25.21) 6.86,25.39 8.51,25.39 arc(9.77,25.91) BAT+.1
  Top Layer w1.016: v1(19.56,8.75) v1(20.07,8.75) ; 20.07,8.88 22.97,8.88
  Top Layer w1.27: v1(19.56,8.75) 18.2,8.75 arc(18.16,8.77) SW4.2
  Inner2 w0.508: 16.64,22.83 16.64,22.26 ; 16.64,22.98 v1(16.64,22.85) arc(16.66,23.1) v1(16.64,23.36) arc(15.57,25.68) 13.21,26.66 12.81,26.66 arc(12.15,26.79) v1(11.59,27.17) ; v1(10.92,27.68) 12.16,27.68 v1(12.16,27.17) v1(10.92,27.17) v1(10.92,27.68)
  Bottom Layer w0.203: 20.19,28.31 20.07,28.31 16.79,25.03 16.76,25.03
  Bottom Layer w0.381: R23.1 20.58,28.7 20.19,28.31
  Bottom Layer w0.508: v1(10.92,27.68) 12.16,27.68 v1(12.16,27.17)
  Bottom Layer w0.635: v1(10.92,27.68) v1(10.92,27.17) ; v1(10.92,27.17) v1(12.16,27.17) ; v1(10.92,27.17) arc(11.24,27.46) 11.58,27.71 arc(11.8,27.85) 12.02,27.97 arc(12.98,28.32) 13.99,28.44 14.7,28.44 arc(15.2,28.34) 15.62,28.06 ; 15.63,28.06 16.58,26.26 ; 16.76,25.03 16.76,25.85 arc(16.73,26.01) 16.64,26.15 ; 17.02,25.52 17.02,25.39
  Bottom Layer w0.762: 16.76,25.03 16.76,24.37 v1(16.64,23.36) v1(16.64,22.85) v1(16.64,22.34) 16.76,21.63 arc(16.9,20.71) 17.09,19.8
  Bottom Layer w0.889: 17.09,19.8 arc(17.45,18.49) 18.03,17.26
  Bottom Layer w0.94: 18.03,17.26 18.67,16.63
  Bottom Layer w1.016: 18.67,16.63 arc(19.47,15.89) 20.07,14.98 arc(20.16,13.07) 19.94,11.17
  Bottom Layer w1.143: 19.94,11.17 19.94,8.25
BATFY: length 11.2
  Top Layer w0.254: STM32.18 24.89,25.9 v1(24.64,26.15)
  Inner1 w0.254: v1(24.64,26.15) 23.55,27.24 22.66,27.24 arc(22.46,27.38) 22.22,27.42 arc(21.87,27.49) 21.57,27.69 20.64,28.62 arc(20.09,29.02) v1(19.43,29.2)
  Bottom Layer w0.254: v1(19.43,29.2) 20.44,30.21 R23.2 20.68,31.22 R22.1
BATFYPW: length 6.2
  Top Layer w0.254: v1(17.27,26.91) 18.22,26.91 STM32.41
  Bottom Layer w0.229: R22.2 19.3,31.11 19.3,29.96 18.8,29.45 18.8,28.44 v1(17.27,26.91)
CHRG: length 10.1
  Top Layer w0.229: 17.69,27.92 17.5,27.92 16.92,28.5 v1(16.92,28.67)
  Top Layer w0.254: 9.65,29.33 9.53,29.33 v1(9.27,29.07)
  Inner1 w0.254: v1(9.27,29.07) 12.19,29.07 v1(12.95,29.84)
  Bottom Layer w0.254: v1(16.92,28.67) 16.14,29.45 14.73,29.45 14.35,29.84 v1(12.95,29.84)
DAC-L: length 35.5
  Inner2 w0.508: v1(7.11,34.79) 7.11,34.41 arc(6.89,33.87) 6.35,33.64 4.15,33.64 arc(3.46,33.36) 3.18,32.67 3.18,26.15 arc(2.88,25.43) 2.16,25.14 arc(1.02,24.67) 0.55,23.53 0.55,15.79 arc(1.35,14.48) 2.79,13.96 8.73,13.96 arc(9.45,14.26) v1(9.75,14.98)
  Bottom Layer w0.381: C26.2 7.56,33.99 R18.1
DAC-R: length 27
  Inner2 w0.508: v1(5.72,14.98) 4.95,14.98 arc(3.43,15.61) 2.79,17.14 2.79,21.62 arc(2.93,22.29) 3.3,22.85 arc(3.77,23.55) 3.94,24.38 3.94,31.99 arc(4.2,32.62) 4.83,32.88 6.6,32.88 arc(6.72,32.89) 6.83,32.9 arc(7.58,33.34) 7.87,34.15 arc(8.06,34.6) 8.51,34.79 v1(10.03,34.79)
  vias: v1(6.99,32.88)
ERJI: length 25.8
  Top Layer w0.229: v1(19.41,28.49) 19.36,28.44 18.69,28.44
  Inner1 w0.254: v1(18.54,15.1) 12.95,9.52 v1(11.43,9.52)
  Inner2 w0.254: v1(19.41,28.49) 17.96,28.49 17.91,28.44 17.91,24.12 17.27,23.48 17.27,21.71 17.53,21.45 17.53,17.77 18.54,16.75 v1(18.54,15.1)
ESP3V3: length 15.2
  Bottom Layer w0.254: U9.2 24.38,7.48 26.54,5.32 27.94,5.32 28.5,5.88 U9.4
  Bottom Layer w0.381: U9.2 23.3,7.48 arc(22.68,7.22) C41.2
  Bottom Layer w0.635: TP1.1 27.54,9.55 arc(28.25,8.48) U9.4
ESPRX: length 19
  Top Layer w0.254: STM32.30 22.73,29.2 23.37,28.56 23.88,28.56 v1(24.26,28.95)
  Inner2 w0.508: v1(23.88,15.23) 23.24,15.86 23.24,27.93 v1(24.26,28.95)
  Bottom Layer w0.508: TP11.1 24.39,15.23 v1(23.88,15.23)
ESPTX: length 30.6
  Top Layer w0.254: STM32.31 22.23,28.94 v1(22.48,28.69)
  Inner2 w0.508: 32.64,12.06 30.48,9.9 24.51,9.9 22.37,12.03 22.37,28.59 v1(22.48,28.69)
  vias: v1(32.65,12.05)
ESPVCC: length 38.5
  Top Layer w0.254: v1(19.94,27.42) 19.92,27.4 STM32.40
  Top Layer w0.635: v1(24.79,8.66) arc(24.87,8.85) 25.06,8.93 v1(25.27,8.93) arc(25.33,9.07) 25.48,9.13 v1(25.78,9.13) v1(25.78,8.12) 25.54,8.12 arc(25.35,8.2) v1(25.27,8.38) 25.07,8.38 arc(24.87,8.46) v1(24.79,8.66) ; v1(24.79,8.66) arc(24.8,8.64) 24.83,8.63 v1(25.78,8.63)
  Inner1 w0.203: v1(24.26,25.52) 23.05,25.52 arc(22.05,25.72) 21.21,26.28 arc(21.11,26.42) 21.08,26.59 21.08,26.86 arc(21.05,27.03) 20.96,27.17 20.92,27.21 arc(20.82,27.27) 20.7,27.3 20.57,27.3 v1(19.94,27.42)
  Bottom Layer w0.254: v1(24.26,25.52) 25.02,24.76 25.02,23.61 25.15,23.49 25.15,22.85 24.64,22.34 24.64,18.28 21.59,15.23 21.59,10.53 22.59,9.53 U9.3
  Bottom Layer w0.635: 24.83,8.66 arc(24.9,8.85) 25.09,8.93 v1(25.27,8.93) arc(25.33,9.07) 25.48,9.13 v1(25.78,9.13) ; v1(25.78,9.13) v1(25.78,8.12) 25.54,8.12 arc(25.35,8.2) v1(25.27,8.38) 25.07,8.38 arc(24.87,8.46) v1(24.79,8.66) 23.59,8.66 arc(23.34,8.76) 23.24,9.01 25.65,9.01 arc(25.74,9.04) v1(25.78,9.13)
HPOUT: length 7.5
  Top Layer w0.381: ASRPRO.17 16.57,15.17 arc(17.25,15.45) v1(17.53,16.12)
  Bottom Layer w0.381: C51.2 15.62,19.55 arc(16.07,19.36) 16.26,18.91 16.26,17.39 arc(16.63,16.49) v1(17.53,16.12)
KEY1: length 19.8
  Top Layer w0.254: STM32.2 20.23,20.85 19.81,20.44 v1(18.29,20.44) ; v1(31.37,15.86) 30.65,16.59 SW1.1
  Inner1 w0.254: v1(18.29,20.44) 21.08,20.44 23.24,18.28 28.96,18.28 v1(31.37,15.86)
KEY2: length 16.5
  Top Layer w0.254: STM32.10 24.23,23.2 v1(24.38,23.36) ; SW1.2 30.27,11.59 v1(31.37,12.69)
  Inner2 w0.381: v1(31.37,12.69) 26.99,17.07 arc(25.06,19.96) v1(24.38,23.36)
KEY3: length 14.2
  Top Layer w0.254: v1(25.91,20.82) 25.02,20.82 24.73,21.11 STM32.11 ; SW1.T v1(31.33,14.09)
  Inner1 w0.254: v1(31.33,14.09) 32.26,15.02 32.26,16.25 27.69,20.82 v1(25.91,20.82)
MICBIAS: length 8.4
  Top Layer w0.381: ASRPRO.22 14.03,11.99 arc(13.63,11.82) 13.46,11.42 13.46,8.55 arc(13.43,8.39) 13.34,8.25 13.04,7.95 arc(12.98,7.85) 12.95,7.74 12.95,7.08 arc(13.02,6.75) v1(13.21,6.47)
  Bottom Layer w0.508: R9.2 13.08,6.33 arc(13.15,6.32) C4.1
MICN_L: length 8
  Top Layer w0.381: ASRPRO.20 13.92,13.26 arc(13.51,13.39) 13.08,13.33 arc(12.87,13.09) 12.7,12.82 arc(12.59,12.02) 12.7,11.23 v1(12.7,8.5)
  Bottom Layer w0.508: C10.2 12.56,8.17 arc(12.66,8.32) v1(12.7,8.5)
MICN_R: length 3.5
  Top Layer w0.381: ASRPRO.19 16.24,13.9 arc(17.41,13.96) v1(18.54,14.21)
MICP_L: length 13.8
  Top Layer w0.381: ASRPRO.21 16.07,12.63 arc(17.17,12.24) v1(17.65,11.17)
  Bottom Layer w0.381: v1(17.65,11.17) 17.65,6.98 arc(17.13,5.72) 15.88,5.2 v1(12.45,5.2)
MICP_R: length 8.2
  Top Layer w0.254: ASRPRO.18 16.7,14.53 arc(17.73,14.96) 18.16,15.99 arc(17.94,16.53) 17.4,16.75 arc(17.04,16.9) 16.89,17.26 16.89,18.72 arc(16.72,19.13) C43.2
MP3RX: length 18.7
  Top Layer w0.254: 25.32,22.34 v1(25.65,22.34) 25.23,21.92 STM32.12
  Inner1 w0.381: v1(12.63,31.75) 15.41,28.97 arc(15.85,28.32) 16,27.55 arc(16.17,26.73) 16.63,26.03 19.68,22.99 arc(20.67,22.32) 21.84,22.09 25.04,22.09 arc(25.37,22.15) v1(25.65,22.34)
MP3TX: length 21.3
  Top Layer w0.254: 26.16,22.98 26.16,23.42 ; STM32.13 26.73,23.3 v1(26.92,23.1)
  Inner1 w0.381: v1(26.92,23.1) 26.42,23.61 25.53,23.61 25.42,23.72 arc(25.1,24.18) 24.77,24.63 arc(24.5,24.72) 24.23,24.76 20.32,24.19 19.15,24.63 arc(18.88,25.3) 18.8,26.03 18.8,26.37 arc(18.53,27.69) 17.78,28.82 17.29,29.31 arc(16.99,29.51) 16.64,29.58 arc(16.28,29.65) 15.99,29.85 13.59,32.25 arc(13.31,32.44) 12.98,32.5 12.7,32.5 arc(12.49,32.46) 12.31,32.34 v1(11.99,32.02)
MP3VCC: length 42.9
  Top Layer w0.254: STM32.32 21.73,31.35 v1(21.72,31.36)
  Top Layer w0.635: v1(3.56,20.18) v1(4.06,20.18)
  Inner2 w0.254: v1(12.7,30.47) 13.59,31.36 v1(21.72,31.36)
  Bottom Layer w0.254: 13.14,34.54 12.15,33.55 11.42,33.55 arc(11.24,33.5) 11.05,33.48 11.04,33.48 10.69,33.14 YX5200_24SS.4 ; 11.21,30.6 10.74,31.07 10.69,31.07 ; 11.21,30.6 10.76,30.15 10.69,30.15 ; 11.21,30.6 10.92,30.6 10.69,30.82 ; 11.21,30.6 11.34,30.47 v1(12.7,30.47) 14.35,30.47 14.95,29.87 C27.2
  Bottom Layer w0.508: v1(3.56,20.18) 4.57,20.18 8.13,23.74 8.13,26.15 10.69,28.72 10.69,30.15 ; 10.2,30.09 10.69,29.63 ; YX5200_24SS.4 10.69,31.07 ; 8002A.6 10.29,30.09 10.69,30.5 10.69,30.82
MP33V3: length 31.7
  Top Layer w0.254: v1(18.54,7.36) 17.65,7.36 17.4,7.61 17.4,8.25 17.02,8.63 17.02,9.52 v2(16.76,9.77)
  Inner2 w0.508: v1(10.03,33.01) v1(10.03,32.5) 10.03,26.79 10.92,25.9 13.34,25.9 15.24,23.99 v1(15.24,22.34) 16.76,20.82 v2(16.76,9.77)
  Bottom Layer w0.254: C29.1 v1(18.54,7.36)
MPU6050-SCL: length 13
  Top Layer w0.254: STM32.46 18.2,24.37 17.02,24.37 16.76,24.12 10.29,24.12 9.52,23.36 8.76,23.36 7.87,22.47 7.11,22.47 6.88,22.24 MPU-6050.23
MPU6050-SDA: length 14.6
  Top Layer w0.229: R31.1 7.62,23.36 8.38,24.12 9.53,24.12 10.03,24.63 12.32,24.63 12.93,25.24 13.61,25.24 13.94,24.91 13.94,24.65 14.1,24.5 16.66,24.5 17.06,24.9 STM32.45
  Top Layer w0.254: 6.38,21.45 6.38,22.5 7.24,23.36 R31.1
MPU6050INT: length 18.8
  Top Layer w0.254: v1(9.14,16.75) 9.14,16.85 MPU-6050.12 ; v1(19.56,26.79) 19.17,26.4 STM32.42
  Inner1 w0.254: v1(17.91,22.85) 17.91,21.2 13.46,16.75 v1(9.14,16.75)
  Inner2 w0.254: v1(19.56,26.79) 18.67,25.9 18.67,23.61 v1(17.91,22.85)
OLED-CS: length 3.6
  Top Layer w0.254: STM32.25 25.23,33.66 24.99,33.9
OLED-D0: length 12.2
  Top Layer w0.254: v1(24.64,31.87) 24.73,31.78 STM32.26
  Inner2 w0.381: v1(24.64,31.87) 24.38,32.12 15.88,32.12 15.49,32.5 v1(15.49,33.77)
OLED-D1: length 7.8
  Top Layer w0.254: 23.75,30.42 STM32.28 23.73,31.38 23.11,31.99
  Top Layer w0.33: 19.61,31.99 23.11,31.99
  Top Layer w0.381: H1.1 19.61,31.99
OLED-DC: length 4.2
  Top Layer w0.254: TP18.1 24,33.24 24,31.74 24.23,31.51 STM32.27
OLED-RES: length 7.1
  Top Layer w0.254: STM32.29 23.23,29.47 v1(23.5,29.2)
  Bottom Layer w0.254: v1(23.5,29.2) 23.5,30.65 H1.2
SPKL+: length 41.2
  Top Layer w0.254: 15.91,20.61 15.55,20.25 arc(14.99,19.92) v1(14.35,19.8)
  Top Layer w0.635: 2.41,36.6 arc(2.52,36.67) 2.64,36.69 v1(3.68,36.69) ; v1(3.68,37.2) 2.54,37.2
  Inner1 w0.381: v1(14.35,19.8) 8.26,19.8 arc(4.57,21.33) 3.05,25.01 3.05,30.85 arc(2.76,31.74) 2.01,32.3 arc(1.77,32.36) v1(1.52,32.38)
  Inner2 w0.508: 2.14,33.03 arc(2.14,33) 2.12,32.97 v1(1.52,32.38) v1(2.03,32.38) 2.03,32.42 arc(2.16,33.08) 2.54,33.65 arc(3.39,34.91) 3.68,36.4 v1(3.68,36.69) v1(3.68,37.2)
  Bottom Layer w0.508: 1.91,32.38 2.71,31.57 arc(3.24,30.77) 3.43,29.84 arc(3.55,29.25) 3.88,28.75 4.08,28.55 arc(5.19,27.81) 6.49,27.55
  Bottom Layer w0.635: v1(1.52,32.38) v1(2.03,32.38)
SPKL-: length 7.6
  Bottom Layer w0.635: SPK1.1 3.11,35.9 arc(3.72,34.98) 3.94,33.9 arc(4.08,33.17) 4.49,32.55 5.69,31.36 8002A.5
STDBY: length 1.6
  Top Layer w0.254: v1(8.51,29.33) 8.51,29.84 8.13,30.22 TP4057.5
STM32-RESET: length 14.2
  Top Layer w0.254: RES.1 33.78,21.71 32.98,20.9 C40.2 31.69,20.83 R21.2 30.09,20.69 28.96,20.69 28.32,20.06 23.7,20.06 22.73,21.03 STM32.7
STM323V3: length 62.5
  Top Layer w0.203: C56.2 28.45,30.03 28.45,29.33 28.02,28.9 STM32.24 ; R21.1 30.23,22.72 30.51,23.01 33.24,23.01 33.47,23.23
  Top Layer w0.254: 20.96,24.77 21.35,24.37 21.42,24.37 ; 21.34,28.02 21.34,27.56 21.35,27.56 ; 19.98,23.4 19.73,23.15 STM32.1 ; 19.98,23.4 STM32.48 ; 19.98,23.4 20.96,24.37 ; 20.96,24.37 20.96,27.17 21.59,27.8 ; 20.96,24.37 24.13,24.37 v1(24.38,24.12) 23.73,23.47 STM32.9 ; 21.59,27.8 19.56,29.84 ; 21.59,27.8 24.26,27.8 25.36,28.9 STM32.24
  Top Layer w0.381: 19.56,29.84 19.56,30.47 18.67,31.36 15.04,31.36 14.99,31.42 ; 28.35,22.06 29.55,22.06 arc(29.92,22.13) R21.1
  Top Layer w0.508: 15.05,30.98 14.86,31.17 LDO1.2
  Top Layer w0.635: SW1.C 35.31,9.21 v1(35.31,9.64)
  Inner2 w0.254: v1(24.38,24.12) 25.02,24.12 25.38,23.76 28.55,23.76 v1(30.23,22.09)
  Bottom Layer w0.254: v1(35.31,9.64) 35.31,17.01 v1(30.23,22.09)
SWCLK: length 1.5
  Top Layer w0.254: STM32.37 18.23,29.76 SWC.1
SWDIO: length 7.4
  Top Layer w0.254: STM32.34 20.73,29.55 v1(21.72,28.56)
  Inner1 w0.254: v1(26.29,29.84) 22.87,29.84 21.72,28.68 v1(21.72,28.56)
W25_CLK: length 11.6
  Top Layer w0.254: STM32.15 26.73,24.4 v1(25.78,24.4)
  Inner2 w0.381: v1(33.27,31.95) 25.76,24.43 v1(25.78,24.4)
W25_CS: length 5.6
  Top Layer w0.254: STM32.14 30.39,23.9 30.73,24.25 W25Q128.1
W25_DI: length 11.2
  Top Layer w0.254: v1(28.19,25.52) 28.08,25.4 STM32.17
  Inner2 w0.381: v1(34.54,31.95) 34.54,31.94 34.54,30.85 29.21,25.52 v1(28.19,25.52)
W25_DO: length 8.4
  Top Layer w0.254: W25Q128.2 32,27.04 31.62,27.42 30.23,27.42 29.72,26.91 29.72,25.9 28.72,24.9 STM32.16
$1N4061: length 1.9
  Top Layer w0.254: ASRPRO.1 22.13,10.72 arc(22.22,10.7) C1.1
$1N4165: length 9.4
  Top Layer w0.254: ASRPRO.23 16.19,11.36 16.89,10.66 17.15,10.66 17.96,9.84 22.93,9.84 23.37,10.28 23.37,10.59
$1N4629: length 2
  Top Layer w0.254: ASRPRO.15 13.39,16.44 arc(13.26,16.49) 13.2,16.63
$1N4632: length 5.3
  Top Layer w0.254: ASRPRO.14 15.81,17.07 arc(16.22,17.24) 16.38,17.64 16.38,17.9 arc(16.27,18.17) 16,18.28 14.1,18.28 13.72,18.65 13.72,19.04
$1N8101: length 12.1
  Top Layer w0.254: STM32.3 20.73,20.54 25.14,16.12 X2.2 25.01,13.7 25.01,11.88 25.15,11.74
$1N8116: length 12.3
  Top Layer w0.254: STM32.4 21.23,21.05 27.69,14.59 27.69,13.84 X2.1 ; 27.74,12.02 27.74,13.55 27.7,13.59
$1N13001: length 4.7
  Top Layer w0.254: 11.85,23.41 11.85,23.27 11.18,22.6 8.84,22.6 8.38,22.14 MPU-6050.20
$1N18271: length 5.9
  Bottom Layer w0.381: CARD1.4 16.22,14.94 C24.2 17.13,14.35 17.65,13.83 17.65,12.17 17.27,11.79 R15.1
$1N19813: length 2.3
  Bottom Layer w0.381: YX5200_24SS.1 8.74,34.32 arc(8.81,34.47) 8.96,34.53
$1N21929: length 3.9
  Bottom Layer w0.381: 9.39,32.76 9.39,33.33 arc(9.43,33.5) 9.53,33.64 arc(9.81,33.83) 10.14,33.9 11.05,33.9 arc(11.28,33.95) 11.48,34.08 11.68,34.28 arc(11.76,34.39) 11.79,34.53 11.79,34.91
  vias: v2(12.19,34.79)
$1N25250: length 2.3
  Inner2 w0.381: v1(7.24,24.5) 7.49,24.75 v1(9.4,24.75)
$1N25574: length 5.4
  Bottom Layer w0.635: 8002A.3 8002A.2 2.16,28.82 3.56,27.42 3.56,26.22 C35.2
$1N25838: length 2.1
  Bottom Layer w0.635: C34.2 5.53,33.64 arc(5.69,33.68) 5.83,33.77 5.91,33.69 R17.2
$1N28732: length 2
  Top Layer w0.254: R19.2 17.27,25.4 STM32.44
$1N28884: length 1.7
  Top Layer w0.254: 28.32,27.05 28.17,26.9 STM32.20
$1N48134: length 5.1
  Bottom Layer w0.254: YX5200_24SS.16 13.94,24.65 14.48,24.12 14.73,24.12 ; 14.48,24.76 14.1,24.76 14.73,24.12 ; 14.73,24.12 14.59,24.26 YX5200_24SS.15 ; 14.73,24.12 14.98,24.12 R26.1
$1N59995: length 5.2
  Bottom Layer w0.508: 10.59,4.93 10.59,6.22 ; 10.59,4.93 R7.2 9.51,5.93 arc(9.46,6.15) MIC1.1 10.31,6.34 arc(10.46,6.31) 10.59,6.22 ; 10.59,4.93 arc(10.6,4.94) C11.1 ; 10.59,6.22 arc(10.57,6.28) R9.1
$1N60004: length 6.7
  Bottom Layer w0.508: R7.1 8,6.18 arc(7.98,6.27) MIC1.2 7.94,7.43 arc(7.96,7.53) R8.1 arc(8.1,8.09) 8.38,8.49 8.38,8.5 arc(8.52,8.59) 8.69,8.63 10.11,8.63 arc(10.27,8.59) 10.41,8.5 10.42,8.49 arc(10.65,8.15) C10.1
$1N65824: length 11.5
  Top Layer w0.635: TP4057.4 7.54,31.46 arc(7.52,31.54) 7.47,31.62 arc(7.53,31.88) 7.68,32.11 C46.1 arc(7.64,32.15) 7.36,32.1 TYPE-C.B9 ; TP4057.4 7.83,31.46 arc(7.99,31.7) 8.05,31.99 ; TP4057.4 7.29,31.42 arc(6.54,31.92) TYPE-C.B9 ; TYPE-C.A9 5.18,29.1 arc(4.75,29.28) 4.57,29.71 4.57,31.61 arc(4.72,31.97) 5.08,32.12 5.62,32.12 arc(5.64,32.11) TYPE-C.B9
$1N68620: length 1.2
  Top Layer w0.254: 7.54,29.27 7.37,29.09 R30.1
$1N71742: length 6.5
  Top Layer w0.254: STM32.5 21.73,22.84 v1(21.59,22.98)
  Bottom Layer w0.254: 19.11,19.8 19.11,21.47 X1.3 18.84,21.87 19.81,22.85 21.46,22.85 v1(21.59,22.98)
$1N71792: length 5.3
  Top Layer w0.254: STM32.6 22.23,23.23 21.84,23.61 v1(21.21,23.61)
  Bottom Layer w0.254: v1(21.21,23.61) 20.87,23.95 X1.1 20.53,25.88 20.51,25.9
$1N75228: length 5.6
  Top Layer w0.254: MPU-6050.10 7.88,16.49 8.25,16.12 9.4,16.12 11.5,18.22 11.81,18.22
$1N77970: length 3.3
  Top Layer w0.381: 14.22,20.56 14.82,20.56 arc(14.84,20.56) 14.84,20.54 ; 14.22,20.84 14.59,20.84 arc(14.78,20.76) v1(14.86,20.56)
  Bottom Layer w0.381: 14.84,20.54 arc(14.96,20.83) 15.25,20.95 C51.1 arc(15.45,20.68) 15.18,20.56 v1(14.86,20.56)
$1N78232: length 2.9
  Top Layer w0.508: 17.53,19.55 17.78,19.8 17.53,20.06 ; 17.53,19.55 17.53,19.29 C43.1 18.28,19.29 arc(18.29,19.3) 18.3,19.31 ; 17.53,19.55 17.53,20.06 ; 17.53,20.06 17.53,20.43 ; 17.38,20.4 arc(17.33,20.52) 17.21,20.57
$1N78327: length 29
  Top Layer w0.381: v1(14.22,21.58) 14.22,22.21 arc(14.22,22.21) R33.1
  Inner1 w0.381: v1(14.22,21.58) 6.99,21.58 arc(4.74,22.51) 3.81,24.75 3.81,31.23 arc(3.1,32.94) v1(1.4,33.64)
  Bottom Layer w0.508: R16.1 3.17,33.48 arc(3.12,33.6) C34.1 v1(1.4,33.64) arc(1.13,33.59) 0.89,33.45 arc(0.7,33.19) 0.63,32.88 0.63,31.87 arc(0.78,31.51) 8002A.4

## Copper pours and planes (outline as drawn; the poured copper is in the pictures)
GND on Top Layer: -9.14,46.22 45.85,46.22 45.85,-7.12 -9.14,-7.12
GND on Bottom Layer: -4.32,41.65 40.26,41.65 40.26,-1.91 -4.32,-1.91
GND on Inner1: -8.25,44.19 42.04,44.19 42.04,-4.71 -8.25,-4.71
GND on Inner2: -6.35,42.79 40.89,42.79 40.89,-3.95 -6.35,-3.95

## Text on the board
Top Silkscreen Layer: GND
